# EAGLE design climbingRGB_pogo (EAGLE 6.3)
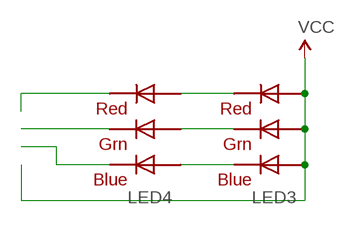
[diagram p0: schematic, sheet 1]

## Parts
LED3  RGBLED5050  [RGBLED5050]
LED4  RGBLED5050  [RGBLED5050]

## Nets
N$1: LED3.4(BLUE_C) LED4.3(BLUE_A)
N$5: LED3.6(GREEN_C) LED4.1(GREEN_A)
N$6: LED3.5(RED_C) LED4.2(RED_A)
VCC: LED3.1(GREEN_A) LED3.2(RED_A) LED3.3(BLUE_A)
VCC_B: LED4.5(RED_C)
VCC_G: LED4.6(GREEN_C)
VCC_R: LED4.4(BLUE_C)

## Library data of the parts
LED3 LED4 = adafruit:RGBLED: For 5050 RGB LEDs, the order of the LEDs may vary from one manufacturer to another!

## Board
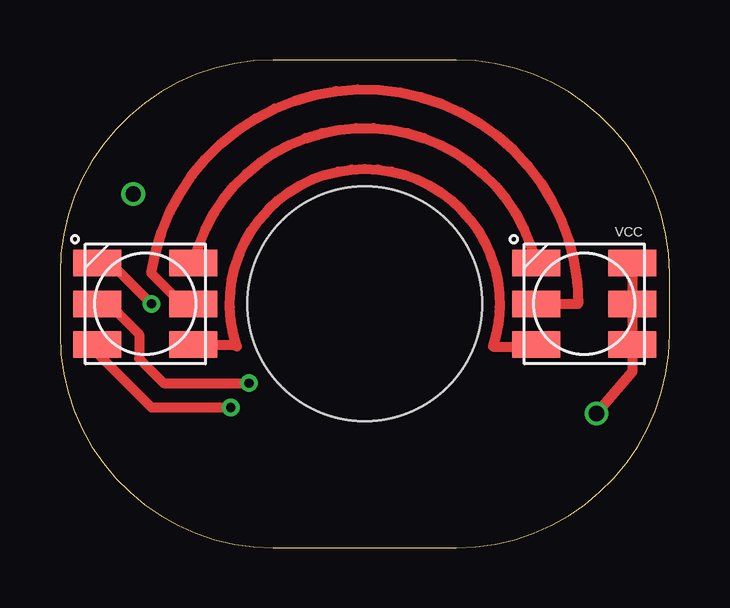
[diagram p1: board, top side]
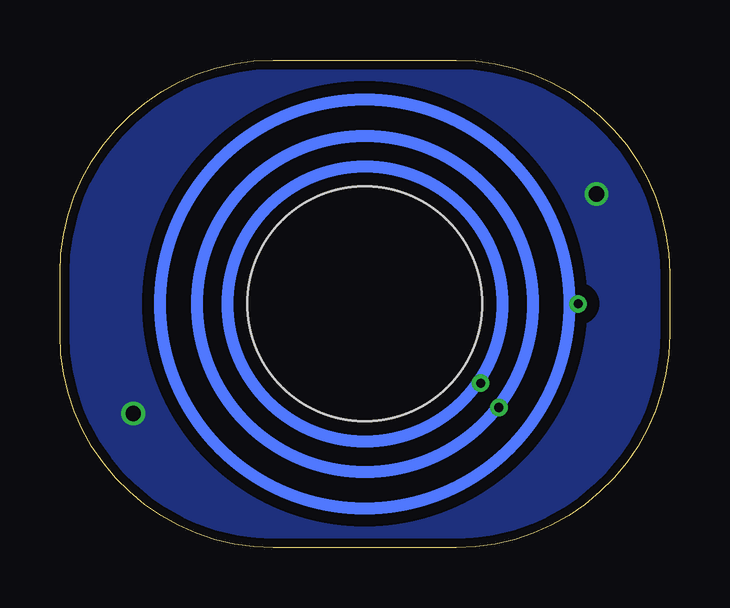
[diagram p2: board, bottom side, seen from below]

Size 25.4 x 20.32 mm. Coordinates in mm from the lower left corner, seen from the top.
Outline: 8.89,0 16.51,0 arc90 25.4,8.89 25.4,11.43 arc90 16.51,20.32 8.89,20.32 arc90 0,11.43 0,8.89 arc90 8.89,0
Copper layers (1*16): Top 0.0356mm / dielectric 1.5011mm / Bottom 0.0356mm
Design rules "LaenPCBOrder *": minimum track width 6mil, minimum drill 13mil, track to track 20mil, track to pad 6mil, pad to pad 6mil, via to via 6mil, smd to smd 6mil, copper to edge 15mil, drill to drill 6mil, minimum pad ring 7mil, minimum via ring 7mil, stop-mask expansion 4mil, vias tented up to drill 0mil, thermal gap 10mil
Holes 9.78 mm at 12.7,10.16

### Footprints (pad centres in the part's own frame; a part is rotated, then mirrored left to right if it is on the bottom)
RGBLED5050 = smd 2 x 1.1: 1 -2,1.7; 2 -2,0; 3 -2,-1.7; 4 2,-1.7; 5 2,0; 6 2,1.7

### Placement (x,y rotation side)
LED3  21.84,10.16 180 top
LED4  3.56,10.16 180 top

### Tracks (layer width: path | path; a pad name or v marks a point on that pad's centre or on a via)
N$1
  Top 0.406: LED4.3 5.56,11.91 5.59,11.94 arc-152 19.81,11.94 19.81,11.89 LED3.4
N$5
  Top 0.406: LED4.1 7.29,8.46 7.37,8.38 arc-217 18.03,8.38 20.02,8.38 LED3.6
N$6
  Top 0.406: LED4.2 arc-45 4.74,10.5 3.81,11.43 arc-172 21.59,10.16 LED3.5
VCC  (via drill 0.64)
  Top 0.406: LED3.3 LED3.2 LED3.1 23.84,7.33 v22.35,5.59
  other vias: 3.05,14.73
  pour Bottom: 0,0 0,20.32 25.4,20.32 25.4,0 0.25,0
VCC_B  (via drill 0.38)
  Top 0.406: LED4.5 2.29,10.16 arc45 2.47,9.73 3.3,8.89 3.3,7.87 3.56,7.62 3.68,7.49 4.32,6.86 v7.87,6.86
VCC_G  (via drill 0.38)
  Top 0.406: LED4.6 1.56,8.1 3.81,5.84 v7.11,5.84
VCC_R  (via drill 0.38)
  Top 0.406: LED4.4 2.11,11.86 v3.81,10.16
(copper drawn outside any net)
  shapes: Bottom circle x3

### Text on the board
tNames: VCC